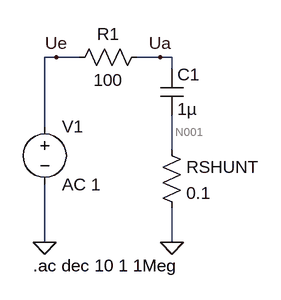
[diagram p0: schematic simulation.asc]
simulation.asc, the LTspice schematic file:
Version 4.1
SHEET 1 880 680
WIRE 144 -16 128 -16
WIRE 176 -16 144 -16
WIRE 288 -16 256 -16
WIRE 304 -16 288 -16
WIRE 304 0 304 -16
WIRE 128 80 128 -16
WIRE 304 112 304 64
WIRE 128 240 128 160
WIRE 304 240 304 192
FLAG 128 240 0
FLAG 304 240 0
FLAG 288 -16 Ua
FLAG 144 -16 Ue
SYMBOL cap 288 0 R0
SYMATTR InstName C1
SYMATTR Value 1µ
SYMBOL res 272 -32 R90
WINDOW 0 0 56 VBottom 2
WINDOW 3 32 56 VTop 2
SYMATTR InstName R1
SYMATTR Value 100
SYMBOL voltage 128 64 R0
WINDOW 123 0 0 Left 0
WINDOW 39 0 0 Left 0
SYMATTR InstName V1
SYMATTR Value AC 1
SYMBOL res 288 96 R0
SYMATTR InstName RSHUNT
SYMATTR Value 0.1
TEXT 112 272 Left 2 !.ac dec 10 1 1Meg

The netlist it stands for:
* simulation.asc
C1 Ua N001 1µ
R1 Ua Ue 100
V1 Ue 0 AC 1
RSHUNT N001 0 0.1
.ac dec 10 1 1Meg
.backanno
.end

* Results of the author's LTspice run, read from the files saved beside the schematic
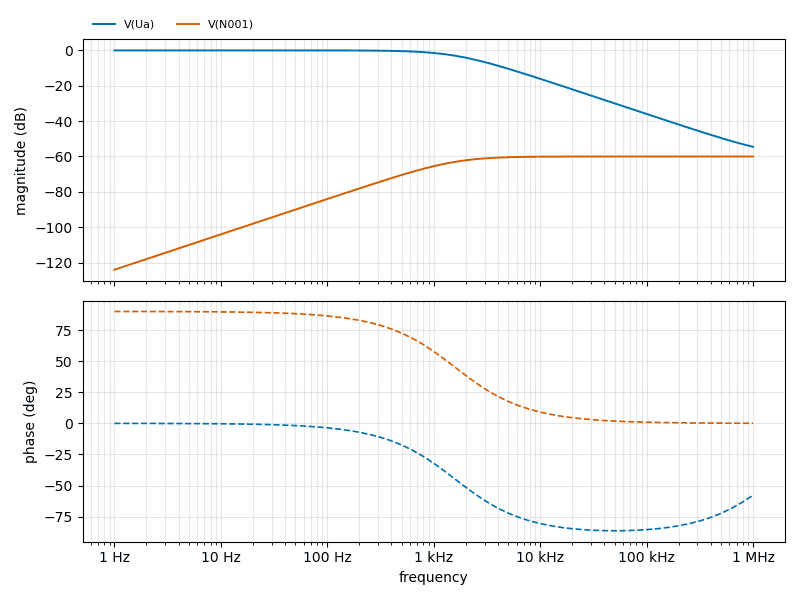
[diagram p1: AC Analysis of simulation.asc, plotted from the saved traces]
* AC Analysis, 1 run:
*   V(Ua): -0.00 dB at 1 Hz, -54.53 dB at 1 MHz, peak -0.00 dB at 1 Hz, 3 dB below the peak at 1.589 kHz
*   V(N001): -124.04 dB at 1 Hz, -60.01 dB at 1 MHz, peak -60.01 dB at 1 MHz, 3 dB below the peak at 1.591 kHz